# Altium schematic sheet 08_USB_To_UART.SchDoc
size A
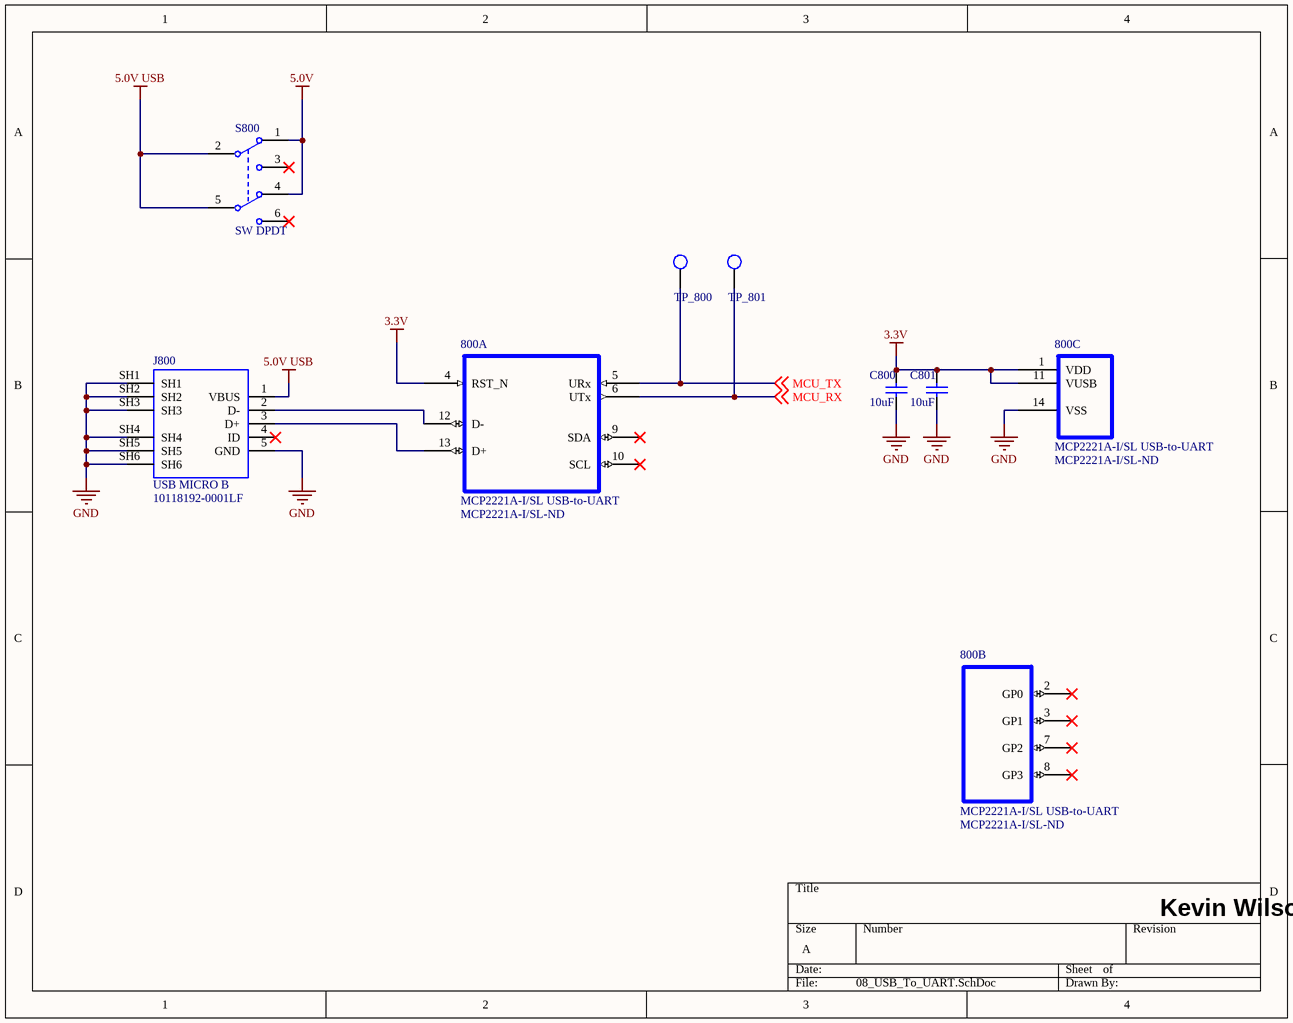
[diagram p0: 08_USB_To_UART.SchDoc]

## Parts
800  MCP2221A-I/SL USB-to-UART  Supplier Part Number 1: MCP2221A-I/SL-ND  [IC_ MCP2221]  (parts A,B,C of 3)
C800  10uF  [CAP_0805]
C801  10uF  [CAP_0805]
J800  value 10118192-0001LF  Tolerance: USB MICRO B  [FCI_10118192]  (hidden comment: CONN_RECP_FCI_10118192-0001LF.1)
S800  SW DPDT  [DPDT]
TP_800  TP_1206  [TP-SMC-1206]  (value not drawn)
TP_801  TP_1206  [TP-SMC-1206]  (value not drawn)

## Nets
3.3V: 800.1(VDD) 800.4(RST_N) 800.11(VUSB) C800.2 C801.2
5.0V: S800.1(NC1) S800.4(NC2)
5.0V USB: J800.1(VBUS) S800.2(COMMON1) S800.5(COMMON2)
GND: 800.14(VSS) C800.1 C801.1 J800.5(GND) J800.SH1 J800.SH2 J800.SH3 J800.SH4 J800.SH5 J800.SH6
MCU_RX: 800.6(UTx) TP_801.1 ; off-sheet MCU_RX
MCU_TX: 800.5(URx) TP_800.1 ; off-sheet MCU_TX
Net800_12: 800.12(D-) J800.2(D-)
Net800_13: 800.13(D+) J800.3(D+)

Not connected (* = marked no-connect by the designer): 800 2(GP0)* 3(GP1)* 7(GP2)* 8(GP3)* 9(SDA)* 10(SCL)*; J800 4(ID)*; S800 3(NO1)* 6(NO2)*

## Notes on the sheet
- Kevin Wilson 2/5/19

## Library data of the parts
800 = MCP2221A-I/SL USB-to-UART: Manufacturer: Microchip; Interface: I2C,UART; Operating Supply Current: 13mA; Manufacturer Part Number: MCP2221A-I/SL; Case/Package: SOIC; Min Operating Temperature: -40°C; Max Operating Temperature: 85°C; Packaging: Rail/Tube; Supplier 1: Digi-Key; Stock 1: 1014; Pricing 1: 1=1.95, 25=1.6276, 100=1.4832 (USD)
C800 C801 = CAP_0805_U_010.00: CAP CER 10UF 16V X5R 0805; Manufacturer: Samsung; Manufacturer Part Number: CL21A106KOFNNNE; Tolerance: 10%; ComponentLink3URL: https://datasheet.ciiva.com/26920/getdatasheetpartid-355170-26920201.pdf; ComponentLink3Description: https://datasheet.ciiva.com/26920/getdatasheetpartid-355170-26920201.pdf; ComponentLink1URL: https://datasheet.ciiva.com/25730/cl21a106kpclqnc-25730594.pdf; ComponentLink1Description: https://datasheet.ciiva.com/25730/cl21a106kpclqnc-25730594.pdf; Mount: Surface Mount; Case/Package: 0805; Case Code (Metric): 2012; Case Code (Imperial): 0805; Min Operating Temperature: -55°C; Max Operating Temperature: 85°C; Packaging: Tape and Reel; Capacitance: 10uF; Voltage Rating: 16V; Package Quantity: 2000; Dielectric: X5R; Length: 2mm; Height: 1.25mm; Width: 0.049inch; Thickness: 0.053inch; Depth: 1.25mm; Radiation Hardening: No; ComponentLink2URL: http://www.samsungsem.com/kr/support/product-search/mlcc/CL21A106KOFNNNE.jsp; ComponentLink2Description: http://www.samsungsem.com/kr/support/product-search/mlcc/CL21A106KOFNNNE.jsp; ComponentLink4URL: http://www1.futureelectronics.com/doc/SAMSUNG/CL21A106KOFNNNE.pdf; ComponentLink4Description: http://www1.futureelectronics.com/doc/SAMSUNG/CL21A106KOFNNNE.pdf; ComponentLink5URL: https://www.verical.com/server-webapp/html/getDatasheet?partID=354009; ComponentLink5Description: https://www.verical.com/server-webapp/html/getDatasheet?partID=354009; Supplier 1: Digi-Key; Stock 1: 1158169; Pricing 1: 1=0.29, 10=0.199, 100=0.1009, 500=0.06904, 1000=0.06107 (USD)
J800 = CONN_RECP_FCI_10118192-0001LF.1: CONN USB MICRO B RECPT SMT R/A; Package: FCI_10118192-0001LF; Supplier 1: Digi-Key; Supplier Part Number 1: 609-4613-1-ND
S800 = SW DPDT: Switch; Manufacturer: ITT /  C&K Components; Manufacturer Part Number: JS202011SCQN; Actuator Color: Black; Maximum DC Voltage Rating: 6 V; Actuator Material: Nylon 4/6; Electrical Life: 15000 Cycles; Body Orientation: Straight; Maximum Contact Resistance: 70 mOhm; Actuator Style: Top Slide; Dielectric Strength: 500 VAC; Minimum Insulation Resistance: 100 MOhm; Contact Rating @ Voltage: 0.3@6VDC A; COO: US; Published: 24-Mar-1999; LatestRevisionDate: 29-May-2009; LatestRevisionNote: IPC-7351 Footprint Added.; PackageVersion: Mar-2001; PackageReference: SOT23-6; Publisher: Altium Limited; PackageDescription: 6-Pin SOT-23 Package 0.95 mm Pitch, 2.7 mm Lead Span; Code_JEITA: SC-74; Code_IPC: SOT26A-6; Supplier 1: C&K Components; Stock 1: 22661; Pricing 1: 1=0.46, 10=0.441, 25=0.4316, 50=0.3858, 100=0.3674, 250=0.3582, 500=0.3031 (USD); Part No: JS202011SCQN; RoHS: Yes; Supplier Standard Pack: 5,000; Type: Sub-Miniature; Maximum AC Voltage Rating: N/A; Family: JS; Contact Material: Copper Alloy; Seal Description: N/A; Pole Throw Configuration: DPDT; Mechanical Life: N/A; Packaging: Tape and Reel; Contact Plating: Silver; Switch Configuration: N/A; Housing Material: Nylon 4/6; Product Weight: N/A; Base Material: N/A; Mounting: Surface Mount,Gull Wing; Seal Location: N/A; Operating Temperature: -40 to 85 C; Dimension: 9 x 7.5 x 5.5 mm; HTS: 8536509050; ECCN: EAR99; ComponentLink1URL: https://datasheet.ciiva.com/23829/1707718-23829488.pdf; ComponentLink1Description: https://datasheet.ciiva.com/23829/1707718-23829488.pdf; ComponentLink2URL: https://datasheet.ciiva.com/2889/js-29aug13-2889127.pdf; ComponentLink2Description: https://datasheet.ciiva.com/2889/js-29aug13-2889127.pdf; ComponentLink3URL: https://datasheet.ciiva.com/2889/js-15sept15-2889128.pdf; ComponentLink3Description: https://datasheet.ciiva.com/2889/js-15sept15-2889128.pdf; ComponentLink4URL: https://datasheet.ciiva.com/2889/js-15sept15-2889129.pdf; ComponentLink4Description: https://datasheet.ciiva.com/2889/js-15sept15-2889129.pdf; ComponentLink5URL: https://datasheet.ciiva.com/22630/1707718-22630697.pdf; ComponentLink5Description: https://datasheet.ciiva.com/22630/1707718-22630697.pdf; ComponentLink6URL: https://datasheet.ciiva.com/8625/js-9dec14-8625470.pdf; ComponentLink6Description: https://datasheet.ciiva.com/8625/js-9dec14-8625470.pdf; Supplier Part Number 1: 401-2002-1-ND
TP_800 TP_801 = TP_1206: Test Point SMD 1206; Manufacturer: TE Connectivity (Tyco Electronics); Manufacturer Part Number: 1625854-1; Resistance Value: 0 Ohm; Temperature Coefficient: N/R; Supplier 1: Digi-Key; Supplier Part Number 1: A106143CT-ND; Stock 1: 31937; Pricing 1: 1=0.28, 10=0.261, 25=0.224, 50=0.1902, 100=0.1828, 250=0.1641, 500=0.1567, 1000=0.1306 (USD); Case Size: 1206; Dimension: 3.2 x 1.6 x 1.25mm; Family: RC; Mounting: Surface Mount; Operating Temperature: -55 to 125 C; Part No: 1625854-1; RoHS: Yes; Packaging: Tape and Reel; Termination Style: N/R; Terminal Pitch: N/R; Power Rating: N/R; Tolerance: N/R; ComponentLink1URL: https://datasheet.ciiva.com/6439/eng-ds-1773266-a-6439169.pdf; ComponentLink1Description: https://datasheet.ciiva.com/6439/eng-ds-1773266-a-6439169.pdf; ComponentLink2URL: https://datasheet.ciiva.com/30136/1773266-a-30136341.pdf; ComponentLink2Description: https://datasheet.ciiva.com/30136/1773266-a-30136341.pdf; ComponentLink3URL: https://datasheet.ciiva.com/6439/eng-ds-1773266-a-6439080.pdf; ComponentLink3Description: https://datasheet.ciiva.com/6439/eng-ds-1773266-a-6439080.pdf; ComponentLink4URL: https://datasheet.ciiva.com/6439/eng-ds-1773266-a-6439081.pdf; ComponentLink4Description: https://datasheet.ciiva.com/6439/eng-ds-1773266-a-6439081.pdf; ComponentLink5URL: https://datasheet.ciiva.com/6439/eng-ds-1773266-a-6439083.pdf; ComponentLink5Description: https://datasheet.ciiva.com/6439/eng-ds-1773266-a-6439083.pdf